# Altium schematic sheet 02 - MCU.SchDoc
size A4; SheetNumber: 2; SheetTotal: 4
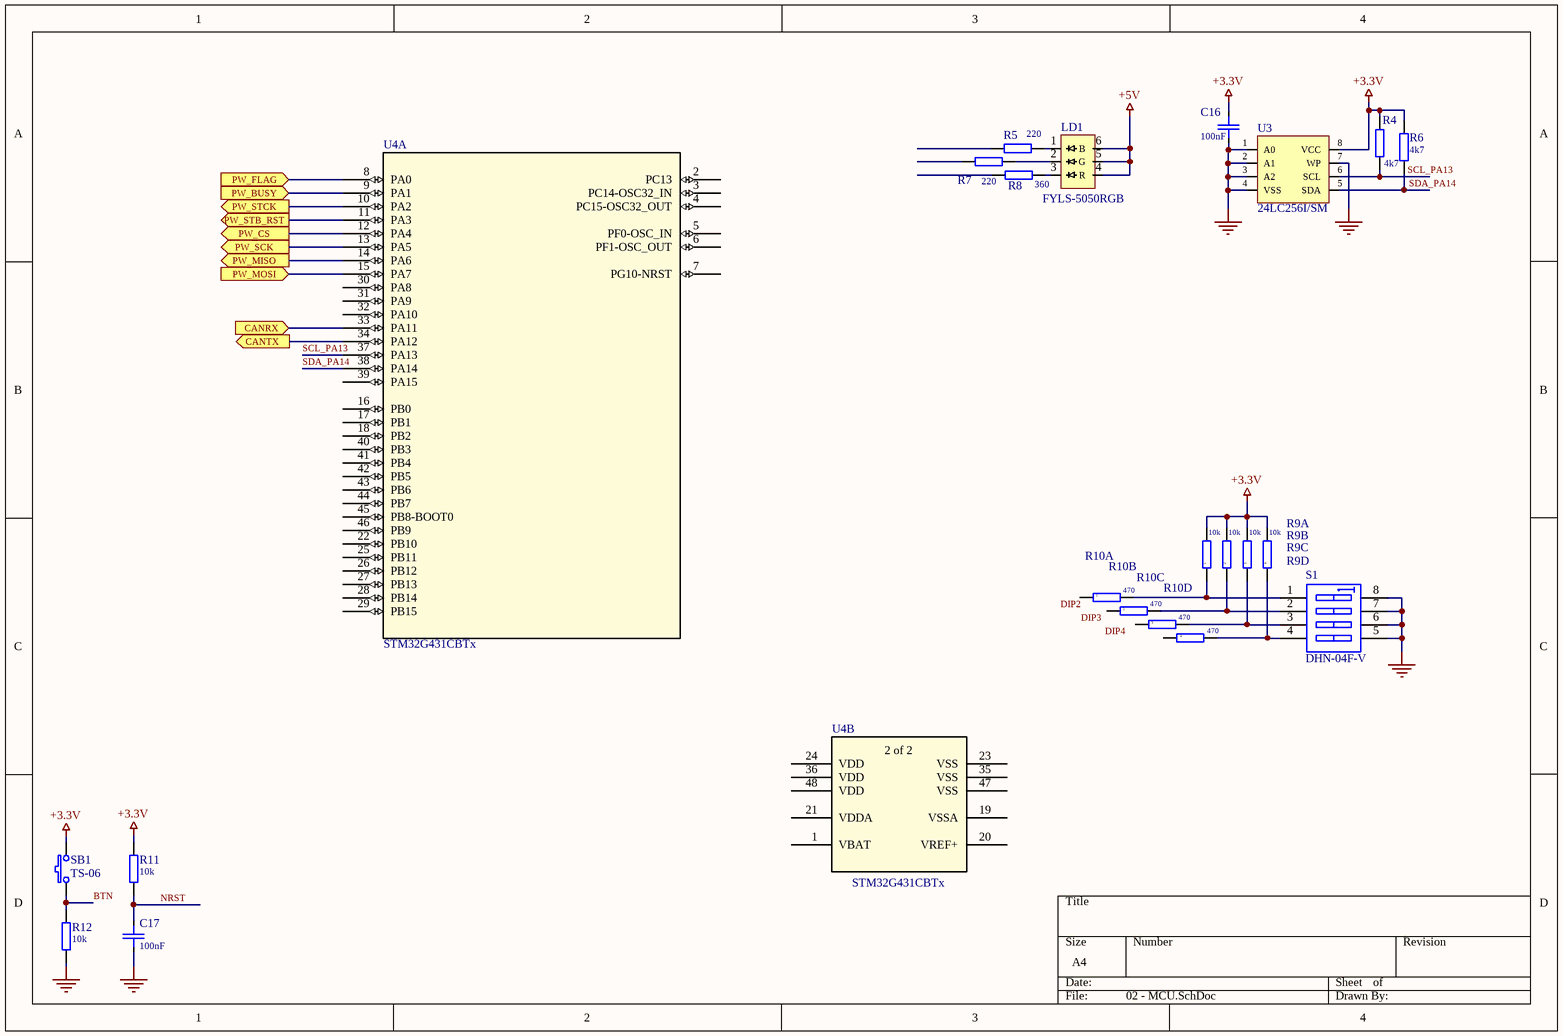
[diagram p0: 02 - MCU.SchDoc]

## Parts
C16  100nF  [CAP: 0805]
C17  100nF  [CAP: 0805]
LD1  FYLS-5050RGB  [FYLS-5050RGB]
R4  4k7  [RES: 0603]
R5  220  [RES: 0603]
R6  4k7  [RES: 0603]
R7  220  [RES: 0603]
R8  360  [RES: 0603]
R9  10k  [RM4x0603]  (parts A,B,C,D of 4)
R10  470  [RM4x0603]  (parts A,B,C,D of 4)
R11  10k  [RES: 0603]
R12  10k  [RES: 0603]
S1  DHN-04F-V  [SOIC-8-DIP_W]
SB1  TS-06  [TS-06]
U3  24LC256I/SM  [SOP-8N (SOIJ)]
U4  STM32G431CBTx  [LQFP48-7x7mm]  (parts A,B of 2)

## Ports
CANRX (in), CANTX (out), PW_BUSY (in), PW_CS (out), PW_FLAG (in), PW_MISO (out), PW_MOSI (in), PW_SCK (out), PW_STB_RST (out), PW_STCK (out)

## Nets
+3.3V: C16.1 R4.2 R6.2 R9.5 R9.6 R9.7 R9.8 R11.1 SB1.2 U3.8(VCC)
+5V: LD1.4(R) LD1.5(G) LD1.6(B)
GND: C16.2 C17.2 R12.2 S1.5(B4) S1.6(B3) S1.7(B2) S1.8(B1) U3.1(A0) U3.2(A1) U3.3(A2) U3.4(VSS) U3.7(WP)
BTN: R12.1 SB1.1
CANRX: U4.33(PA11) ; port CANRX
CANTX: U4.34(PA12) ; port CANTX
NRST: C17.1 R11.2
PW_BUSY: U4.9(PA1) ; port PW_BUSY
PW_CS: U4.12(PA4) ; port PW_CS
PW_FLAG: U4.8(PA0) ; port PW_FLAG
PW_MISO: U4.14(PA6) ; port PW_MISO
PW_MOSI: U4.15(PA7) ; port PW_MOSI
PW_SCK: U4.13(PA5) ; port PW_SCK
PW_STB_RST: U4.11(PA3) ; port PW_STB_RST
PW_STCK: U4.10(PA2) ; port PW_STCK
SCL_PA13: R4.1 U3.6(SCL) U4.37(PA13)
SDA_PA14: R6.1 U3.5(SDA) U4.38(PA14)
NetLD1_1: LD1.1 R5.2
NetLD1_2: LD1.2 R7.2
NetLD1_3: LD1.3 R8.2
NetR9_1: R9.1 R10.8 S1.1(A1)
NetR9_2: R9.2 R10.7 S1.2(A2)
NetR9_3: R9.3 R10.6 S1.3(A3)
NetR9_4: R9.4 R10.5 S1.4(A4)

Not connected (* = marked no-connect by the designer): R5 1; R7 1; R8 1; R10 1 2 3 4; U4 1(VBAT) 2(PC13) 3(PC14-OSC32_IN) 4(PC15-OSC32_OUT) 5(PF0-OSC_IN) 6(PF1-OSC_OUT) 7(PG10-NRST) 16(PB0) 17(PB1) 18(PB2) 19(VSSA) 20(VREF+) 21(VDDA) 22(PB10) 23(VSS) 24(VDD) 25(PB11) 26(PB12) 27(PB13) 28(PB14) 29(PB15) 30(PA8) 31(PA9) 32(PA10) 35(VSS) 36(VDD) 39(PA15) 40(PB3) 41(PB4) 42(PB5) 43(PB6) 44(PB7) 45(PB8-BOOT0) 46(PB9) 47(VSS) 48(VDD)

## Notes on the sheet
- Labels drawn without touching a wire or pin: DIP2, DIP3, DIP4
- (in symbol STM32G431CBTx, part B) 2 of 2

## Library data of the parts
C16 C17 = C-0805: SMD-0805; Price: 0.014; Value: 100nF
R4-R8 R11 R12 = R-0603: SMD 0603 0.0625W 5% 50V; Price: 0.017
  R4 R6: Value: 4k7
  R5 R7: Value: 220
  R8: Value: 360
  R11 R12: Value: 10k
R9 R10 = 4RM-0603: SMD 4RM-0603 1\16W 5%; Price: 0.07; ComponentLink1Description: New link
  R9: Value: 10k; ComponentLink1URL: https://www.electronshik.ru/item/BOURNS/CAT16-103J4LF
  R10: Value: 470; ComponentLink1URL: https://www.electronshik.ru/item/BOURNS/CAT16-471J4LF
S1 = SW DIP-4: DIP Switch, 4 Position, SPST; Published: 24-Mar-1999; LatestRevisionDate: 29-May-2009; LatestRevisionNote: IPC-7351 Footprint Added.; PackageVersion: Dec-2002; PackageReference: SO8; Publisher: Altium Limited; PackageDescription: 8-Pin Small Outline Integrated Circuit 1.27 mm Pitch; Code_JEDEC: MS-012-AA; Code_IPC: SOIC127P600-8; ComponentLink1Description: New link; ComponentLink1URL: https://www.electronshik.ru/item/DIP/DHN-04F-V
SB1 = Buton TS-06: Price: 0.15
U4 = STM32G431CBTx: Mainstream Arm Cortex-M4 core with DSP and FPU, 170MHz with 128Kbytes of Flash memory, Math Accelerator, Medium Analog level integration; Manufacturer_Part_Number: stm32g4_lqfp48_t1; Built_By: EMA_Jessica; Vendor: STMicroelectronics; Copyright: Copyright (C) 2016 Accelerated Designs. All rights reserved; RefDes: RefDes; Type: DEV; Value: Value
LD1 = FYLS-5050RGB: ComponentLink1Description: New link; ComponentLink1URL: https://www.chipdip.ru/catalog/smd-leds?gq=FYLS-5050RGB
U3 = 24LC256I/SM: ComponentLink1Description: New link; ComponentLink1URL: https://www.chipdip.ru/product/24lc256-i-sm